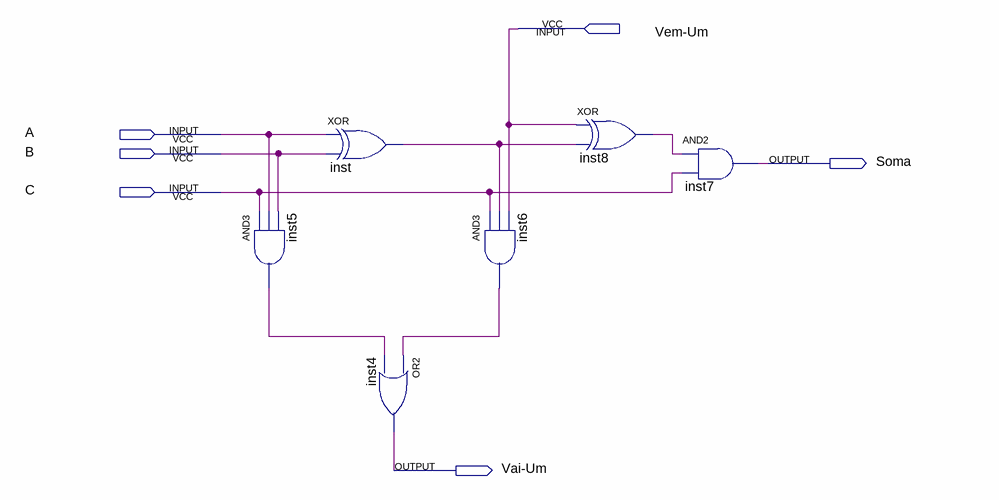
[diagram p0: schematic sheet]
// Quartus schematic full_adder_1bit.bdf as structural Verilog: 6 symbols, 6 pins
module full_adder_1bit (
  input  \Vem-Um ,
  input  A,
  input  B,
  input  C,
  output Soma,
  output \Vai-Um 
);

  wire inst5_out, inst6_out, inst8_out, inst_out;

  and inst5 (inst5_out, C, A, B);
  xor inst (inst_out, A, B);
  or inst4 (\Vai-Um , inst6_out, inst5_out);
  and inst6 (inst6_out, C, inst_out, \Vem-Um );
  xor inst8 (inst8_out, \Vem-Um , inst_out);
  and inst7 (Soma, inst8_out, C);
endmodule
